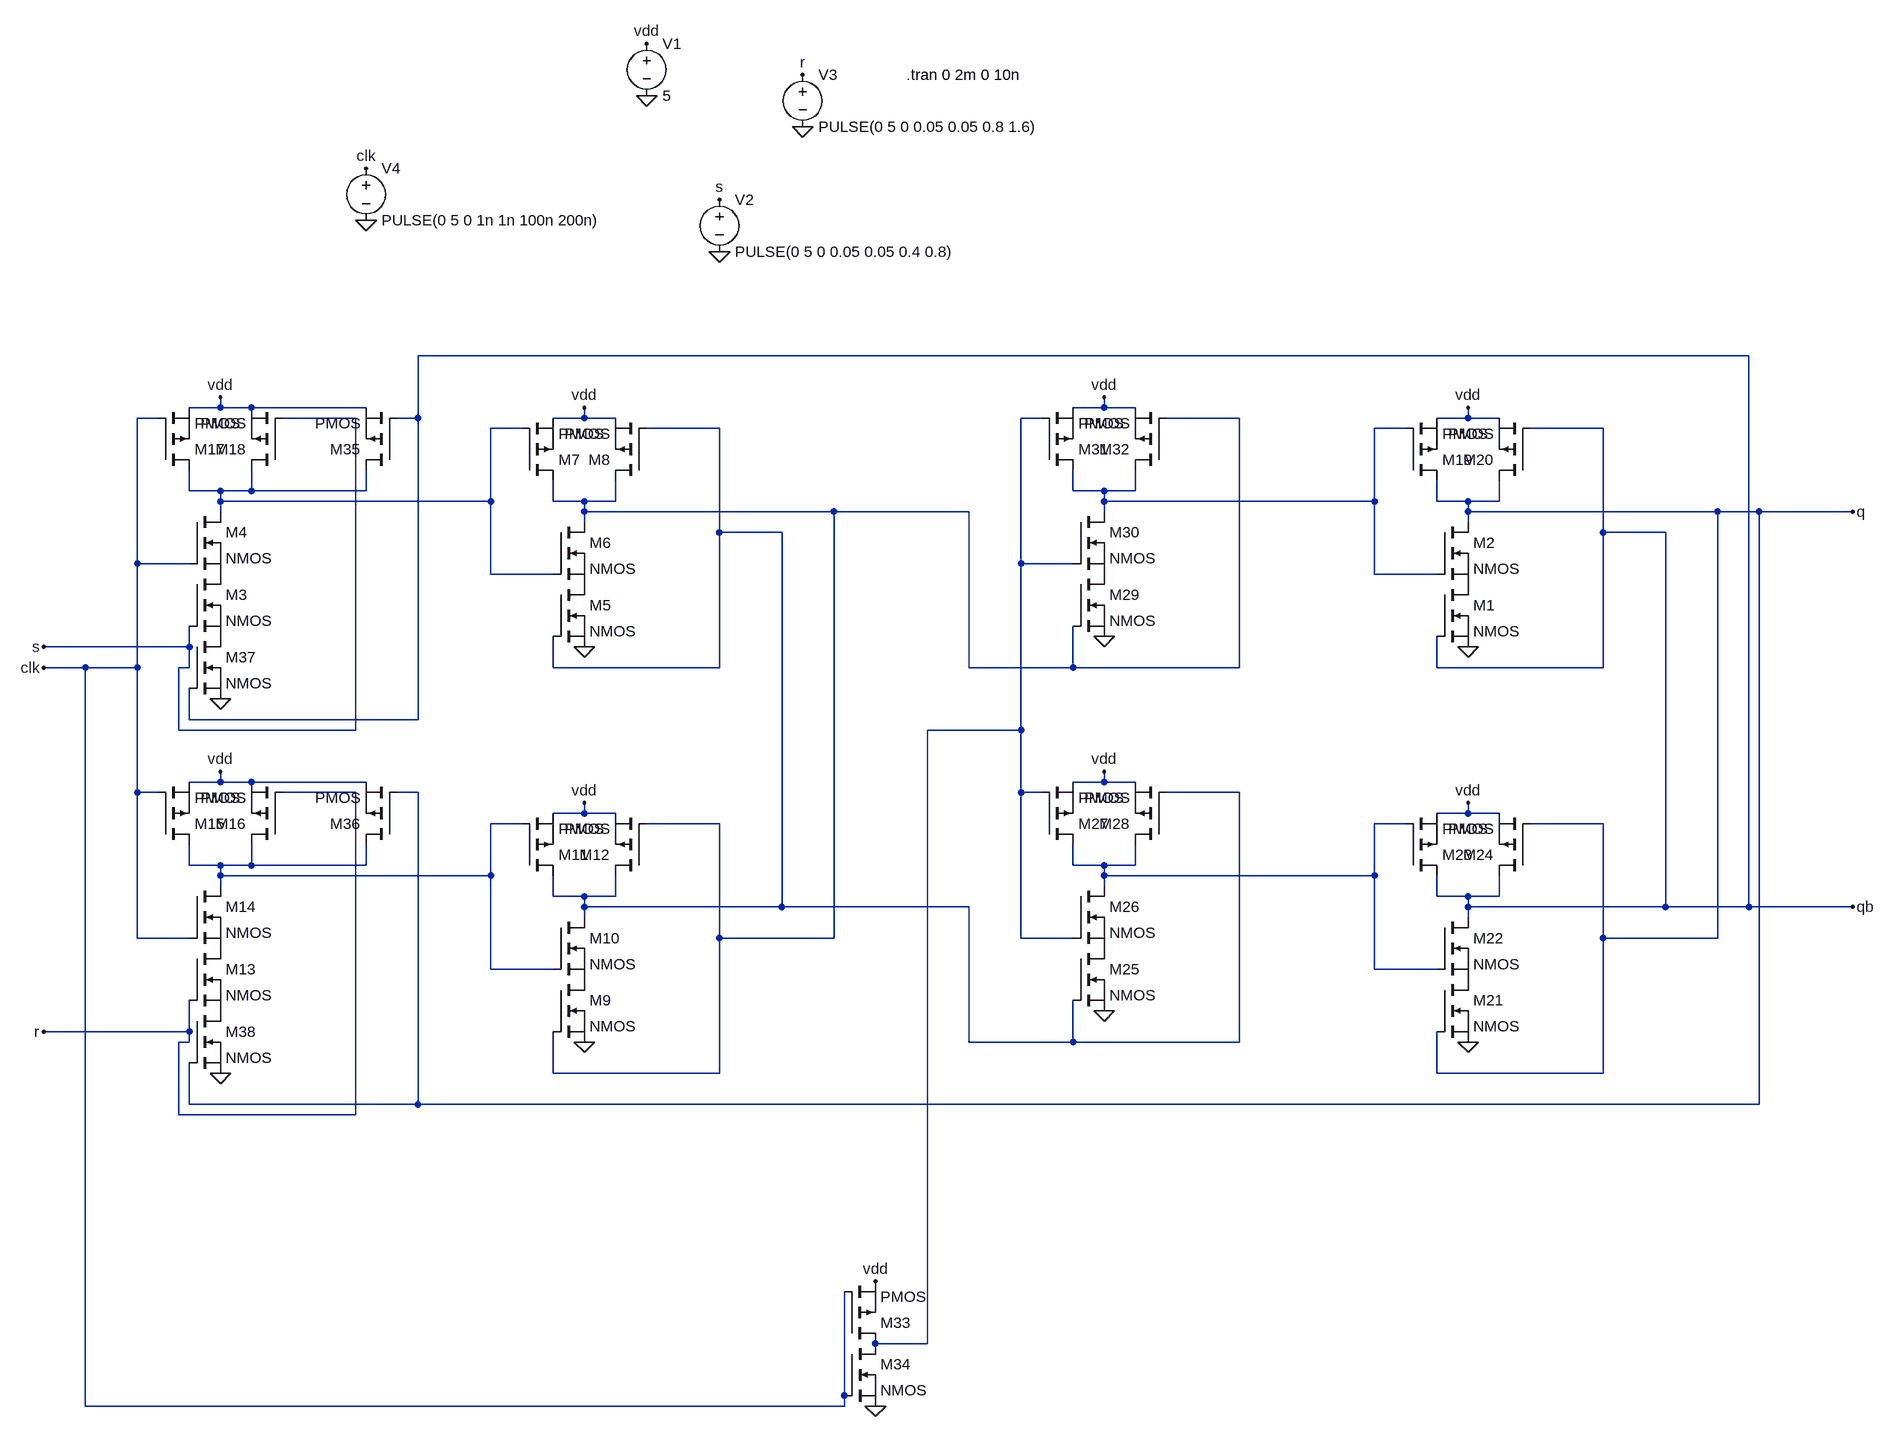
[diagram p0: schematic Sequential Simulation.asc]
Sequential Simulation.asc, the LTspice schematic file:
Version 4.1
SHEET 1 2768 1380
WIRE 2560 -256 512 -256
WIRE 208 -176 208 -192
WIRE 208 -176 160 -176
WIRE 256 -176 208 -176
WIRE 432 -176 256 -176
WIRE 1568 -176 1568 -192
WIRE 1568 -176 1520 -176
WIRE 1616 -176 1568 -176
WIRE 112 -160 80 -160
WIRE 416 -160 304 -160
WIRE 512 -160 512 -256
WIRE 512 -160 480 -160
WIRE 768 -160 768 -176
WIRE 768 -160 720 -160
WIRE 816 -160 768 -160
WIRE 1472 -160 1440 -160
WIRE 1776 -160 1664 -160
WIRE 2128 -160 2128 -176
WIRE 2128 -160 2080 -160
WIRE 2176 -160 2128 -160
WIRE 672 -144 624 -144
WIRE 976 -144 864 -144
WIRE 2032 -144 1984 -144
WIRE 2336 -144 2224 -144
WIRE 160 -48 160 -80
WIRE 208 -48 160 -48
WIRE 256 -48 256 -80
WIRE 256 -48 208 -48
WIRE 432 -48 432 -80
WIRE 432 -48 256 -48
WIRE 1520 -48 1520 -80
WIRE 1568 -48 1520 -48
WIRE 1616 -48 1616 -80
WIRE 1616 -48 1568 -48
WIRE 208 -32 208 -48
WIRE 624 -32 624 -144
WIRE 624 -32 208 -32
WIRE 720 -32 720 -64
WIRE 768 -32 720 -32
WIRE 816 -32 816 -64
WIRE 816 -32 768 -32
WIRE 1568 -32 1568 -48
WIRE 1984 -32 1984 -144
WIRE 1984 -32 1568 -32
WIRE 2080 -32 2080 -64
WIRE 2128 -32 2080 -32
WIRE 2176 -32 2176 -64
WIRE 2176 -32 2128 -32
WIRE 208 -16 208 -32
WIRE 768 -16 768 -32
WIRE 1152 -16 768 -16
WIRE 1360 -16 1152 -16
WIRE 1568 -16 1568 -32
WIRE 2128 -16 2128 -32
WIRE 2512 -16 2128 -16
WIRE 2576 -16 2512 -16
WIRE 2720 -16 2576 -16
WIRE 768 0 768 -16
WIRE 2128 0 2128 -16
WIRE 976 16 976 -144
WIRE 1072 16 976 16
WIRE 2336 16 2336 -144
WIRE 2432 16 2336 16
WIRE 80 64 80 -160
WIRE 160 64 80 64
WIRE 1440 64 1440 -160
WIRE 1520 64 1440 64
WIRE 624 80 624 -32
WIRE 720 80 624 80
WIRE 1984 80 1984 -32
WIRE 2080 80 1984 80
WIRE 160 192 160 160
WIRE 160 192 -64 192
WIRE 0 224 -64 224
WIRE 80 224 80 64
WIRE 80 224 0 224
WIRE 160 224 160 192
WIRE 160 224 144 224
WIRE 720 224 720 176
WIRE 976 224 976 16
WIRE 976 224 720 224
WIRE 1360 224 1360 -16
WIRE 1520 224 1520 160
WIRE 1520 224 1360 224
WIRE 1776 224 1776 -160
WIRE 1776 224 1520 224
WIRE 2080 224 2080 176
WIRE 2336 224 2336 16
WIRE 2336 224 2080 224
WIRE 160 304 160 256
WIRE 512 304 512 -160
WIRE 512 304 160 304
WIRE 144 320 144 224
WIRE 416 320 416 -160
WIRE 416 320 144 320
WIRE 1440 320 1440 64
WIRE 1440 320 1296 320
WIRE 208 400 208 384
WIRE 208 400 160 400
WIRE 256 400 208 400
WIRE 432 400 256 400
WIRE 1568 400 1568 384
WIRE 1568 400 1520 400
WIRE 1616 400 1568 400
WIRE 80 416 80 224
WIRE 112 416 80 416
WIRE 416 416 304 416
WIRE 512 416 480 416
WIRE 1440 416 1440 320
WIRE 1472 416 1440 416
WIRE 1776 416 1664 416
WIRE 768 448 768 432
WIRE 768 448 720 448
WIRE 816 448 768 448
WIRE 2128 448 2128 432
WIRE 2128 448 2080 448
WIRE 2176 448 2128 448
WIRE 672 464 624 464
WIRE 976 464 864 464
WIRE 2032 464 1984 464
WIRE 2336 464 2224 464
WIRE 160 528 160 496
WIRE 208 528 160 528
WIRE 256 528 256 496
WIRE 256 528 208 528
WIRE 432 528 432 496
WIRE 432 528 256 528
WIRE 1520 528 1520 496
WIRE 1568 528 1520 528
WIRE 1616 528 1616 496
WIRE 1616 528 1568 528
WIRE 208 544 208 528
WIRE 624 544 624 464
WIRE 624 544 208 544
WIRE 1568 544 1568 528
WIRE 1984 544 1984 464
WIRE 1984 544 1568 544
WIRE 208 560 208 544
WIRE 1568 560 1568 544
WIRE 720 576 720 544
WIRE 768 576 720 576
WIRE 816 576 816 544
WIRE 816 576 768 576
WIRE 2080 576 2080 544
WIRE 2128 576 2080 576
WIRE 2176 576 2176 544
WIRE 2176 576 2128 576
WIRE 768 592 768 576
WIRE 1072 592 1072 16
WIRE 1072 592 768 592
WIRE 1360 592 1072 592
WIRE 2128 592 2128 576
WIRE 2432 592 2432 16
WIRE 2432 592 2128 592
WIRE 2560 592 2560 -256
WIRE 2560 592 2432 592
WIRE 2720 592 2560 592
WIRE 768 608 768 592
WIRE 2128 608 2128 592
WIRE 80 640 80 416
WIRE 160 640 80 640
WIRE 976 640 976 464
WIRE 1152 640 1152 -16
WIRE 1152 640 976 640
WIRE 1440 640 1440 416
WIRE 1520 640 1440 640
WIRE 2336 640 2336 464
WIRE 2512 640 2512 -16
WIRE 2512 640 2336 640
WIRE 624 688 624 544
WIRE 720 688 624 688
WIRE 1984 688 1984 544
WIRE 2080 688 1984 688
WIRE 160 784 160 736
WIRE 160 784 -64 784
WIRE 160 800 160 784
WIRE 160 800 144 800
WIRE 1360 800 1360 592
WIRE 1520 800 1520 736
WIRE 1520 800 1360 800
WIRE 1776 800 1776 416
WIRE 1776 800 1520 800
WIRE 720 848 720 784
WIRE 976 848 976 640
WIRE 976 848 720 848
WIRE 2080 848 2080 784
WIRE 2336 848 2336 640
WIRE 2336 848 2080 848
WIRE 160 896 160 832
WIRE 512 896 512 416
WIRE 512 896 160 896
WIRE 2576 896 2576 -16
WIRE 2576 896 512 896
WIRE 144 912 144 800
WIRE 416 912 416 416
WIRE 416 912 144 912
WIRE 1296 1264 1296 320
WIRE 1296 1264 1216 1264
WIRE 1168 1344 1168 1184
WIRE 0 1360 0 224
WIRE 1168 1360 1168 1344
WIRE 1168 1360 0 1360
FLAG 864 -656 0
FLAG 976 -416 0
FLAG 1104 -608 0
FLAG 864 -736 vdd
FLAG 768 192 0
FLAG 768 -176 vdd
FLAG 768 800 0
FLAG 768 432 vdd
FLAG 976 -496 s
FLAG 1104 -688 r
FLAG 208 384 vdd
FLAG 208 -192 vdd
FLAG -64 224 clk
FLAG -64 784 r
FLAG -64 192 s
FLAG 432 -464 0
FLAG 432 -544 clk
FLAG 2128 192 0
FLAG 2128 -176 vdd
FLAG 2128 800 0
FLAG 2128 432 vdd
FLAG 2720 592 qb
FLAG 2720 -16 q
FLAG 1568 752 0
FLAG 1568 384 vdd
FLAG 1568 176 0
FLAG 1568 -192 vdd
FLAG 1216 1360 0
FLAG 1216 1168 vdd
FLAG 208 272 0
FLAG 208 848 0
SYMBOL voltage 864 -752 R0
WINDOW 123 0 0 Left 0
WINDOW 39 0 0 Left 0
SYMATTR InstName V1
SYMATTR Value 5
SYMBOL voltage 976 -512 R0
WINDOW 123 0 0 Left 0
WINDOW 39 0 0 Left 0
SYMATTR InstName V2
SYMATTR Value PULSE(0 5 0 0.05 0.05 0.4 0.8)
SYMBOL voltage 1104 -704 R0
WINDOW 123 0 0 Left 0
WINDOW 39 0 0 Left 0
SYMATTR InstName V3
SYMATTR Value PULSE(0 5 0 0.05 0.05 0.8 1.6)
SYMBOL nmos 720 96 R0
SYMATTR InstName M5
SYMBOL nmos 720 0 R0
SYMATTR InstName M6
SYMBOL pmos 672 -64 M180
SYMATTR InstName M7
SYMBOL pmos 864 -64 R180
SYMATTR InstName M8
SYMBOL nmos 720 704 R0
SYMATTR InstName M9
SYMBOL nmos 720 608 R0
SYMATTR InstName M10
SYMBOL pmos 672 544 M180
SYMATTR InstName M11
SYMBOL pmos 864 544 R180
SYMATTR InstName M12
SYMBOL nmos 160 656 R0
SYMATTR InstName M13
SYMBOL nmos 160 560 R0
SYMATTR InstName M14
SYMBOL pmos 112 496 M180
SYMATTR InstName M15
SYMBOL pmos 304 496 R180
SYMATTR InstName M16
SYMBOL nmos 160 80 R0
SYMATTR InstName M3
SYMBOL nmos 160 -16 R0
SYMATTR InstName M4
SYMBOL pmos 112 -80 M180
SYMATTR InstName M17
SYMBOL pmos 304 -80 R180
SYMATTR InstName M18
SYMBOL voltage 432 -560 R0
WINDOW 123 0 0 Left 0
WINDOW 39 0 0 Left 0
SYMATTR InstName V4
SYMATTR Value PULSE(0 5 0 1n 1n 100n 200n)
SYMBOL nmos 2080 96 R0
SYMATTR InstName M1
SYMBOL nmos 2080 0 R0
SYMATTR InstName M2
SYMBOL pmos 2032 -64 M180
SYMATTR InstName M19
SYMBOL pmos 2224 -64 R180
SYMATTR InstName M20
SYMBOL nmos 2080 704 R0
SYMATTR InstName M21
SYMBOL nmos 2080 608 R0
SYMATTR InstName M22
SYMBOL pmos 2032 544 M180
SYMATTR InstName M23
SYMBOL pmos 2224 544 R180
SYMATTR InstName M24
SYMBOL nmos 1520 656 R0
SYMATTR InstName M25
SYMBOL nmos 1520 560 R0
SYMATTR InstName M26
SYMBOL pmos 1472 496 M180
SYMATTR InstName M27
SYMBOL pmos 1664 496 R180
SYMATTR InstName M28
SYMBOL nmos 1520 80 R0
SYMATTR InstName M29
SYMBOL nmos 1520 -16 R0
SYMATTR InstName M30
SYMBOL pmos 1472 -80 M180
SYMATTR InstName M31
SYMBOL pmos 1664 -80 R180
SYMATTR InstName M32
SYMBOL pmos 1168 1264 M180
SYMATTR InstName M33
SYMBOL nmos 1168 1264 R0
SYMATTR InstName M34
SYMBOL pmos 480 -80 R180
SYMATTR InstName M35
SYMBOL pmos 480 496 R180
SYMATTR InstName M36
SYMBOL nmos 160 176 R0
SYMATTR InstName M37
SYMBOL nmos 160 752 R0
SYMATTR InstName M38
TEXT 1264 -688 Left 2 !.tran 0 2m 0 10n

The netlist it stands for:
* Sequential Simulation.asc
V1 vdd 0 5
V2 s 0 PULSE(0 5 0 0.05 0.05 0.4 0.8)
V3 r 0 PULSE(0 5 0 0.05 0.05 0.8 1.6)
M5 P001 N004 0 0 NMOS
M6 N002 N003 P001 P001 NMOS
M7 N002 N003 vdd vdd PMOS
M8 N002 N004 vdd vdd PMOS
M9 P002 N002 0 0 NMOS
M10 N004 N006 P002 P002 NMOS
M11 N004 N006 vdd vdd PMOS
M12 N004 N002 vdd vdd PMOS
M13 P003 r P004 P004 NMOS
M14 N006 clk P003 P003 NMOS
M15 N006 clk vdd vdd PMOS
M16 N006 r vdd vdd PMOS
M3 P005 s P006 P006 NMOS
M4 N003 clk P005 P005 NMOS
M17 N003 clk vdd vdd PMOS
M18 N003 s vdd vdd PMOS
V4 clk 0 PULSE(0 5 0 1n 1n 100n 200n)
M1 P007 qb 0 0 NMOS
M2 q N005 P007 P007 NMOS
M19 q N005 vdd vdd PMOS
M20 q qb vdd vdd PMOS
M21 P008 q 0 0 NMOS
M22 qb N007 P008 P008 NMOS
M23 qb N007 vdd vdd PMOS
M24 qb q vdd vdd PMOS
M25 P009 N004 0 0 NMOS
M26 N007 N001 P009 P009 NMOS
M27 N007 N001 vdd vdd PMOS
M28 N007 N004 vdd vdd PMOS
M29 P010 N002 0 0 NMOS
M30 N005 N001 P010 P010 NMOS
M31 N005 N001 vdd vdd PMOS
M32 N005 N002 vdd vdd PMOS
M33 N001 clk vdd vdd PMOS
M34 N001 clk 0 0 NMOS
M35 N003 qb vdd vdd PMOS
M36 N006 q vdd vdd PMOS
M37 P006 qb 0 0 NMOS
M38 P004 q 0 0 NMOS
.model NMOS NMOS
.model PMOS PMOS
.lib standard.mos
.tran 0 2m 0 10n
.backanno
.end